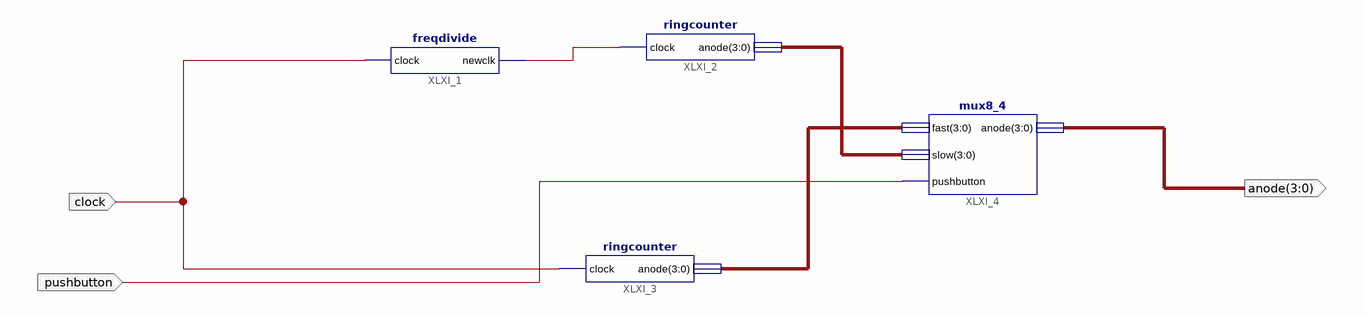
[diagram p0: schematic sheet 1]
// Xilinx ISE schematic clockdivider.sch (artix7) as structural Verilog: 4 symbols, 3 ports
module clockdivider (
  input  pushbutton,
  input  clock,
  output [3:0] anode
);

  wire XLXN_3;
  wire [3:0] XLXN_4, XLXN_6;

  freqdivide XLXI_1 (.clock(clock), .newclk(XLXN_3));
  ringcounter XLXI_2 (.anode(XLXN_4), .clock(XLXN_3));
  ringcounter XLXI_3 (.anode(XLXN_6), .clock(clock));
  mux8_4 XLXI_4 (.anode(anode), .fast(XLXN_6), .pushbutton(pushbutton), .slow(XLXN_4));
endmodule
